# Altium schematic sheet [03] - LCD.SchDoc: Mantra Display Board
size A4; Author: MikrySoft; Address1: MikrySoft@gmail.com; DocumentNumber: 4; Revision: 1; SheetNumber: 4; SheetTotal: 7
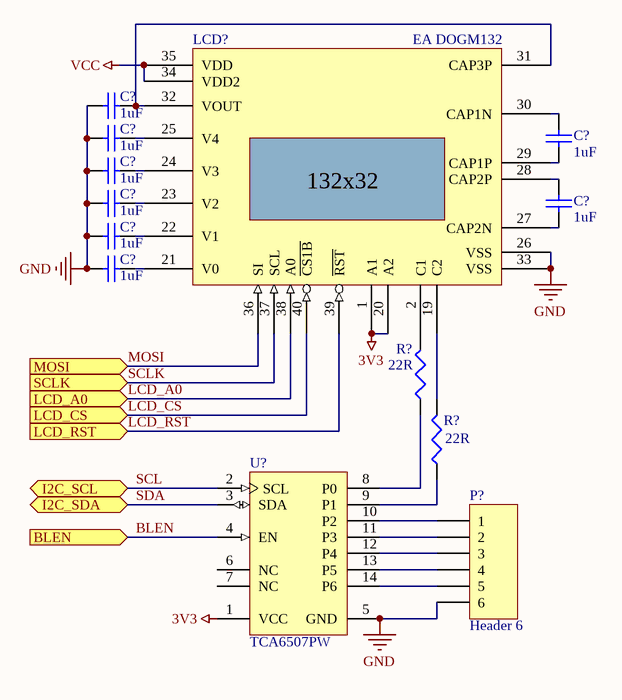
[diagram p0: [03] - LCD.SchDoc]

## Parts
(Parts that share a designator on the sheet are numbered #1, #2 ... from top to bottom, then left to right.)
C?#1  value 1uF  [1608[0603]]  (hidden comment: Cap Semi)
C?#2  value 1uF  [1608[0603]]  (hidden comment: Cap Semi)
C?#3  value 1uF  [1608[0603]]  (hidden comment: Cap Semi)
C?#4  value 1uF  [1608[0603]]  (hidden comment: Cap Semi)
C?#5  value 1uF  [1608[0603]]  (hidden comment: Cap Semi)
C?#6  value 1uF  [1608[0603]]  (hidden comment: Cap Semi)
C?#7  value 1uF  [1608[0603]]  (hidden comment: Cap Semi)
C?#8  value 1uF  [1608[0603]]  (hidden comment: Cap Semi)
LCD?  EA DOGM132  [EA DOGM132-5]
P?  Header 6  [HDR1X6]
R?#1  value 22R  [J1-0603]  (hidden comment: Res3)
R?#2  value 22R  [J1-0603]  (hidden comment: Res3)
U?  TCA6507PW  [PW14_M]

## Ports
BLEN (in), I2C_SCL (bidir), I2C_SDA (bidir), LCD_A0 (in), LCD_CS (in), LCD_RST (in), MOSI (in), SCLK (in)

## Nets
3V3: LCD?.1(A1) LCD?.20(A2) U?.1(VCC)
GND: C?#1.1 C?#2.1 C?#4.1 C?#5.1 C?#7.1 C?#8.1 LCD?.26(VSS) LCD?.33(VSS) P?.6 U?.5(GND)
VCC: LCD?.34(VDD2) LCD?.35(VDD)
BLEN: U?.4(EN) ; port BLEN
LCD_A0: LCD?.38(A0) ; port LCD_A0
LCD_CS: LCD?.40(~{CS1B}) ; port LCD_CS
LCD_RST: LCD?.39(~{RST}) ; port LCD_RST
MOSI: LCD?.36(SI) ; port MOSI
SCL: U?.2(SCL) ; port I2C_SCL
SCLK: LCD?.37(SCL) ; port SCLK
SDA: U?.3(SDA) ; port I2C_SDA
NetC?#1_2: C?#1.2 LCD?.31(CAP3P) LCD?.32(VOUT)
NetC?#2_2: C?#2.2 LCD?.25(V4)
NetC?#3_1: C?#3.1 LCD?.30(CAP1N)
NetC?#3_2: C?#3.2 LCD?.29(CAP1P)
NetC?#4_2: C?#4.2 LCD?.24(V3)
NetC?#5_2: C?#5.2 LCD?.23(V2)
NetC?#6_1: C?#6.1 LCD?.28(CAP2P)
NetC?#6_2: C?#6.2 LCD?.27(CAP2N)
NetC?#7_2: C?#7.2 LCD?.22(V1)
NetC?#8_2: C?#8.2 LCD?.21(V0)
NetLCD?_2: LCD?.2(C1) R?#1.2
NetLCD?_19: LCD?.19(C2) R?#2.2
NetP?_1: P?.1 U?.10(P2)
NetP?_2: P?.2 U?.11(P3)
NetP?_3: P?.3 U?.12(P4)
NetP?_4: P?.4 U?.13(P5)
NetP?_5: P?.5 U?.14(P6)
NetR?#1_1: R?#1.1 U?.8(P0)
NetR?#2_1: R?#2.1 U?.9(P1)

Not connected (* = marked no-connect by the designer): U? 6(NC) 7(NC)

## Notes on the sheet
- Title
- Size:
- Date:
- A4
- Number:
- Time:
- Revision:
- Sheet
- of
- Variation:
- Author:
- E-Mail:
- File:
- (in symbol EA DOGM132) 132x32

## Library data of the parts
C?#1-C?#8 = Cap Semi: Capacitor (Semiconductor SIM Model); Published: 8-Jun-2000; LatestRevisionDate: 29-May-2009; LatestRevisionNote: IPC-7351 Footprint Added.; PackageReference: C1206; Publisher: Altium Limited; PackageDescription: Chip Capacitor
LCD? = EA DOGM132: 132x32 graphical LCD
P? = Header 6: Header, 6-Pin; LatestRevisionDate: 17-Jul-2002; LatestRevisionNote: Re-released for DXP Platform.; Publisher: Altium Limited
R?#1 R?#2 = Res3: Resistor; Published: 8-Jun-2000; LatestRevisionDate: 29-May-2009; LatestRevisionNote: IPC-7351 Footprint Added.; PackageReference: J1-0603; Publisher: Altium Limited; PackageDescription: Chip Resistor
U? = TCA6507PW: Low-Voltage 7-Bit I2C and SMBus LED Driver with Intensity Control and Shutdown, 1.65 to 3.6 V, -40 to 85 degC, 14-pin TSSOP (PW), Green (RoHS & no Sb/Br); Manufacturer: Texas Instruments; SubFamily: I2C Special Function; fSCLK(Max)(MHz): 400; VCC(Min)(V): 1.65; VCC(Max)(V): 3.6; I2C Address: 1000101; Enable Pin: Yes; Rating: Catalog; DatasheetVersion: SCPS164B; PackageVersion: revG, Feb-2011; PackageReference: PW14; PackageDescription: 14-Pin Thin Small Outline Package 0.65 mm Pitch; Supplier 1: Digi-Key; Supplier Part Number 1: TCA6507PW-ND; Supplier 2: Farnell; Supplier Part Number 2: 1647813; Supplier 3: Newark; Supplier Part Number 3: 54M7301; Supplier 4: Mouser; Supplier Part Number 4: 595-TCA6507PW; Eco-Plan: Green (RoHS & no Sb/Br); Max Frequency(kHz): 400; Function: LED Driver; Vcc range(V): 1.65 to 3.6; Open Drain I/O Type: Yes; 5V Tolerant I/O: Yes; On-Chip Power-on-Reset: Yes; Mounting Technology: Surface Mount; PartNumber: TCA6507PW; Code_JEDEC: MO-153; ComponentLink1Description: Datasheet; ComponentLink1URL: http://www.ti.com/general/docs/lit/getliterature.tsp?genericPartNumber=TCA6507&fileType=pdf; ComponentLink2Description: Package Specification; ComponentLink2URL: http://www.ti.com/litv/pdf/mpds177g